# EAGLE design Lichtplatine (EAGLE 6.0)
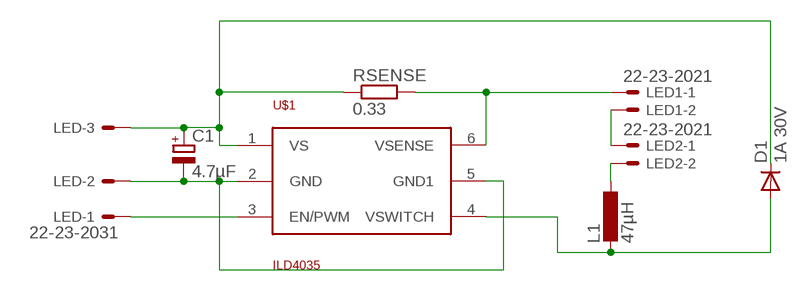
[diagram p0: schematic, sheet 1]

## Parts
C1  4.7µF  CPOL-EUE2.5-5  [E2,5-5]
D1  1A 30V  DIODE-DO41-7.6  [DO41-7.6]
L1  47µH  L-EU6000-XXX-RC  [6000-XXXX-RC]
LED  22-23-2031  [22-23-2031]
LED1  22-23-2021  [22-23-2021]
LED2  22-23-2021  [22-23-2021]
RSENSE  0.33  R-EU_R2010  [R2010]
U$1  ILD4035  [SC74]

## Nets
GND: C1.- LED.2 U$1.2(GND) U$1.5(GND1)
N$2: LED.1 U$1.3(EN/PWM)
N$3: C1.+ D1.C LED.3 RSENSE.1 U$1.1(VS)
N$4: LED1.2 LED2.1
N$5: L1.1 LED2.2
N$6: LED1.1 RSENSE.2 U$1.6(VSENSE)
N$7: D1.A L1.2 U$1.4(VSWITCH)

## Library data of the parts
C1 = rcl:CPOL-EU: POLARIZED CAPACITOR, European symbol
D1 = diode:DIODE-: DIODE
L1 = rcl:L-EU: INDUCTOR, European symbol
LED = con-molex:22-23-2031: .100" (2.54mm) Center Header - 3 Pin; MF: MOLEX; MPN: 22-23-2031; OC_FARNELL: 1462950; OC_NEWARK: 30C0862
LED1 LED2 = con-molex:22-23-2021: .100" (2.54mm) Center Header - 2 Pin; MF: MOLEX; MPN: 22-23-2021; OC_FARNELL: 1462926; OC_NEWARK: 25C3832
RSENSE = rcl:R-EU_: RESISTOR, European symbol
U$1 = SC74:ILD4035

## Board
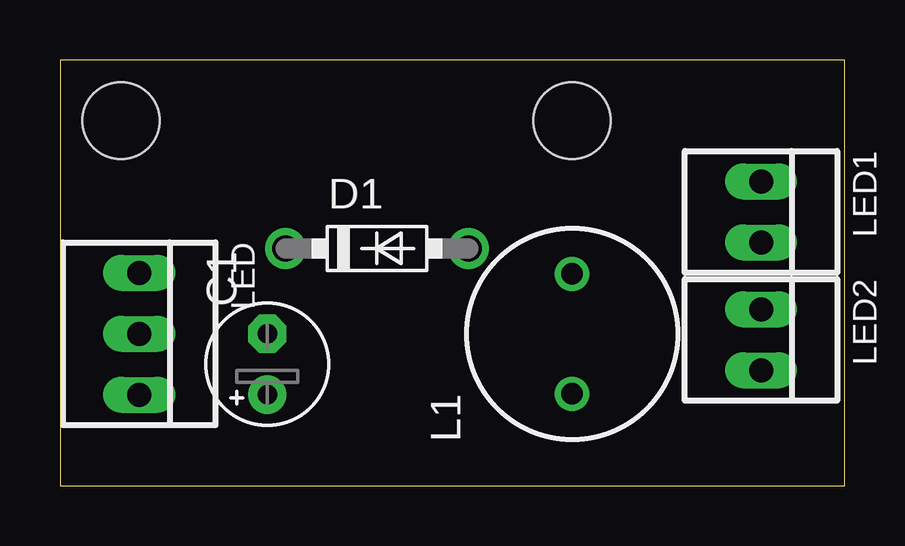
[diagram p1: board, top side]
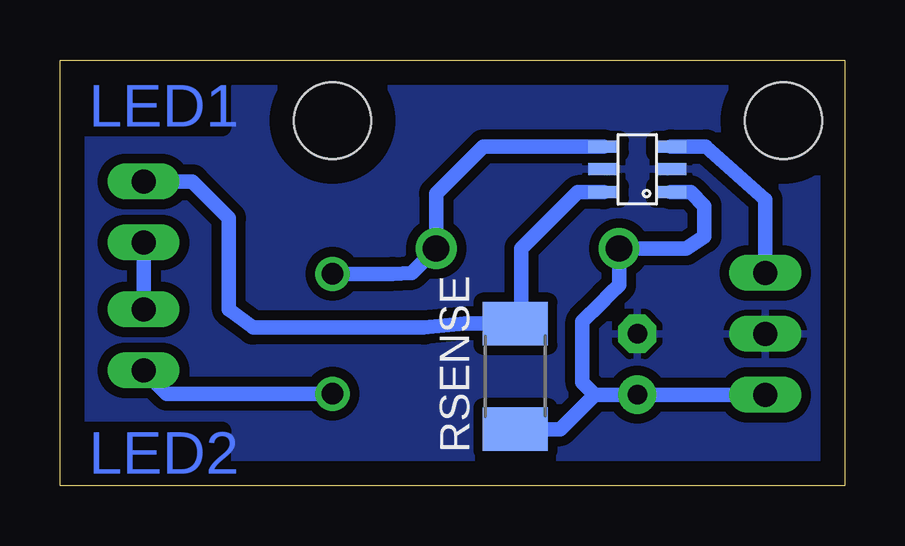
[diagram p2: board, bottom side, seen from below]

Size 32.69 x 17.77 mm. Coordinates in mm from the lower left corner, seen from the top.
Outline: 0,0 32.69,0 32.69,17.77 0,17.77 0,0
Copper layers (1*16): Top 0.035mm / dielectric 1.5mm / Bottom 0.035mm
Design rules: minimum track width 10mil, minimum drill 24mil, track to track 8mil, track to pad 8mil, pad to pad 8mil, via to via 8mil, smd to smd 8mil, copper to edge 40mil, drill to drill 8mil, minimum pad ring 10mil, minimum via ring 8mil, stop-mask expansion 4mil, vias tented up to drill 0mil, thermal gap 10mil
Holes 3.2 mm at 2.54,15.24 21.34,15.24

### Footprints (pad centres in the part's own frame; a part is rotated, then mirrored left to right if it is on the bottom)
E2,5-5 = drill 0.813 pad 1.6: + -1.27,0 | drill 0.813 pad 1.6 octagon: - 1.27,0
DO41-7.6 = drill 1.1 pad 1.7: A 3.81,0; C -3.81,0
6000-XXXX-RC = drill 0.9 pad 1.422: 1 -2.5,0; 2 2.5,0
22-23-2031 = drill 1 long: 1 -2.54,0; 2 0,0; 3 2.54,0
22-23-2021 = drill 1 long: 1 -1.27,0; 2 1.27,0
R2010 = smd 1.8 x 2.7: 1 -2.2,0; 2 2.2,0
SC74 = smd 0.5 x 1.3: 1 -0.95,-1.4; 2 0,-1.4; 3 0.95,-1.4; 4 0.95,1.4; 5 0,1.4; 6 -0.95,1.4

### Placement (x,y rotation side)
C1  8.64,5.08 90 top
D1  13.21,9.91 0 top
L1  21.34,6.35 90 top
LED  3.3,6.35 270 top
LED1  29.21,11.43 270 top
LED2  29.21,6.1 270 top
RSENSE  13.72,4.57 90 bottom
U$1  8.64,13.21 90 bottom

### Tracks (layer width: path | path; a pad name or v marks a point on that pad's centre or on a via)
GND
  pour Bottom (isolate 0.4): 0,17.78 33.02,17.78 33.02,0 0,0
N$2
  Bottom 0.61: U$1.3 5.78,14.16 3.3,11.94 LED.1
N$3
  Bottom 0.61: LED.3 C1.+ 10.41,3.81 | 10.41,3.81 10.92,4.32 10.92,6.86 10.16,7.62 9.78,8 9.4,8.38 D1.C 6.6,9.91 5.84,10.41 5.84,11.68 6.42,12.26 U$1.1 | RSENSE.1 11.85,2.37 10.41,3.81
N$4
  Bottom 0.61: LED1.2 LED2.1
N$5
  Bottom 0.61: L1.1 28.23,3.85 LED2.2
N$6
  Bottom 0.61: LED1.1 27.18,12.7 25.65,11.18 25.65,7.37 24.64,6.6 17.53,6.6 15.83,6.77 RSENSE.2 13.46,7.03 13.46,9.91 11.11,12.26 U$1.6
N$7
  Bottom 0.61: L1.2 18.84,8.85 18.03,8.89 D1.A 17.02,12.19 15.05,14.16 U$1.4

### Text on the board
Bottom: LED1 | LED2
tRestrict: LED1 | LED